# Altium schematic sheet Top Sheet.SchDoc
size A4; DocumentNumber: 1; SheetNumber: 1; SheetTotal: 11
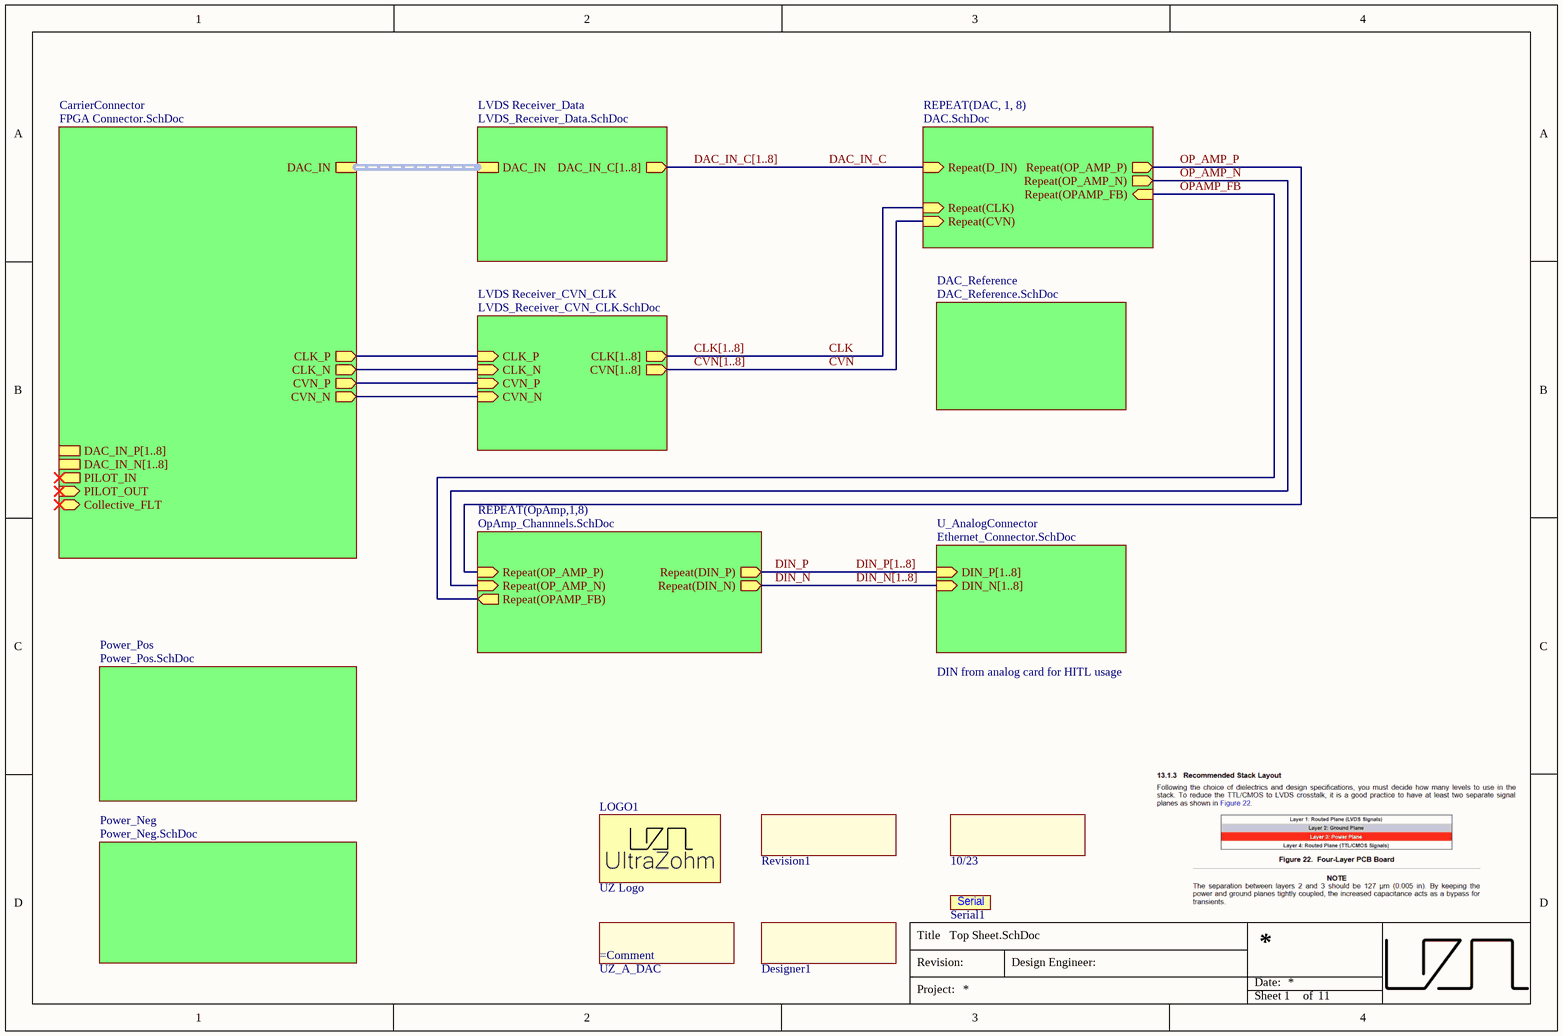
[diagram p0: Top Sheet.SchDoc]

## Parts
10/23  (no value)  [COMMENT]  (no BOM)
Designer1  (no value)  [Designator:comment]  (no BOM)
LOGO1  UZ Logo  [UZ_Logo_small]  (no BOM)
Revision1  (no value)  [Designator:comment]  (no BOM)
Serial1  Serial #  [SERIAL]  (value not drawn)
UZ_A_DAC  (no value)  [COMMENT]  (no BOM)

## Sub-sheets
CarrierConnector = FPGA Connector.SchDoc: CLK_P (out), CLK_N (out), CVN_P (out), CVN_N (out), PILOT_IN (out), PILOT_OUT (in), Collective_FLT (bidir), DAC_IN, DAC_IN_P[1..8], DAC_IN_N[1..8]
DAC_Reference = DAC_Reference.SchDoc: no entries
LVDS Receiver_CVN_CLK = LVDS_Receiver_CVN_CLK.SchDoc: CLK_P (in), CLK_N (in), CVN_P (in), CVN_N (in), CLK[1..8] (out), CVN[1..8] (out)
LVDS Receiver_Data = LVDS_Receiver_Data.SchDoc: DAC_IN, DAC_IN_C[1..8] (out)
Power_Neg = Power_Neg.SchDoc: no entries
Power_Pos = Power_Pos.SchDoc: no entries
REPEAT(DAC, 1, 8) = DAC.SchDoc: Repeat(CLK) (in), Repeat(D_IN) (in), Repeat(CVN) (in), Repeat(OP_AMP_P) (out), Repeat(OP_AMP_N) (out), Repeat(OPAMP_FB) (in)
REPEAT(OpAmp,1,8) = OpAmp_Channnels.SchDoc: Repeat(DIN_P) (out), Repeat(DIN_N) (out), Repeat(OP_AMP_P) (in), Repeat(OP_AMP_N) (in), Repeat(OPAMP_FB) (out)
U_AnalogConnector = Ethernet_Connector.SchDoc: DIN_P[1..8] (in), DIN_N[1..8] (in)

## Nets
CLK: sheet REPEAT(DAC, 1, 8)/Repeat(CLK)
CVN: sheet REPEAT(DAC, 1, 8)/Repeat(CVN)
DAC_IN_C: sheet REPEAT(DAC, 1, 8)/Repeat(D_IN)
DIN_N: sheet REPEAT(OpAmp,1,8)/Repeat(DIN_N)
DIN_P: sheet REPEAT(OpAmp,1,8)/Repeat(DIN_P)
OP_AMP_N: sheet REPEAT(DAC, 1, 8)/Repeat(OP_AMP_N), sheet REPEAT(OpAmp,1,8)/Repeat(OP_AMP_N)
OP_AMP_P: sheet REPEAT(DAC, 1, 8)/Repeat(OP_AMP_P), sheet REPEAT(OpAmp,1,8)/Repeat(OP_AMP_P)
OPAMP_FB: sheet REPEAT(DAC, 1, 8)/Repeat(OPAMP_FB), sheet REPEAT(OpAmp,1,8)/Repeat(OPAMP_FB)
(unnamed): sheet CarrierConnector/CLK_P, sheet LVDS Receiver_CVN_CLK/CLK_P
(unnamed): sheet CarrierConnector/CLK_N, sheet LVDS Receiver_CVN_CLK/CLK_N
(unnamed): sheet CarrierConnector/CVN_P, sheet LVDS Receiver_CVN_CLK/CVN_P
(unnamed): sheet CarrierConnector/CVN_N, sheet LVDS Receiver_CVN_CLK/CVN_N

## Buses and harness runs
bus CLK[1..8] = sheet LVDS Receiver_CVN_CLK/CLK[1..8]
bus CVN[1..8] = sheet LVDS Receiver_CVN_CLK/CVN[1..8]
bus DAC_IN_C[1..8] = sheet LVDS Receiver_Data/DAC_IN_C[1..8]
bus DIN_N[1..8] = sheet U_AnalogConnector/DIN_N[1..8]
bus DIN_P[1..8] = sheet U_AnalogConnector/DIN_P[1..8]
harness sheet CarrierConnector/DAC_IN = sheet LVDS Receiver_Data/DAC_IN

## Notes on the sheet
- DIN from analog card for HITL usage
- Title
- Revision:
- Design Engineer:
- Date:
- Project:
- Sheet
- of
- (in symbol 6) Serial

## Library data of the parts
10/23 = 5: Create a project parameter named "FinDate" this is the value of this component. It is printed on the PCB. Once the parameter is updated (e.g. new revision) it gets updated on the PCB as well; Manufacturer: PCB Manufacturer; Manufacturer Part Number: Project End Date; Created from: T. Wendt; PartID: 5; Created On: 01.03.2021 09:01:41; Component Type: Date of Project Finalization; Last Updated: 01.03.2021 09:01:41; Type: Standard (No BOM); Value: =FinDate; Live Cycle Status: 1
Designer1 = 4: Create a project parameter named "Author" this is the value of this component. It is printed on the PCB. Once the parameter is updated (e.g. new revision) it gets updated on the PCB as well; Manufacturer: PCB Manufacturer; Manufacturer Part Number: Project Author; Created from: T. Wendt; PartID: 4; Created On: 01.03.2021 08:53:41; Component Type: Project Author; Last Updated: 01.03.2021 09:20:27; Type: Standard (No BOM); Value: *; Live Cycle Status: 1
LOGO1 = Logo small: Manufacturer: UltraZohm; Created from: MGremer; Created: Jan2021_Liegmann; Value: Logo; Manufacturer Part Number: Logo small; PartID: 10; Created On: 03.11.2021 09:04:23; ComponentLink1Description: https://docs.ultrazohm.com/; ComponentLink1URL: homepage; Component Type: Logo; Last Updated: 03.11.2021 09:05:50; Supplier 1: -; Supplier Part Number 1: -; Type: Logo; Live Cycle Status: 1
Revision1 = 3: Create a project parameter named "ProjectRevision" this is the value of this component. It is printed on the PCB. Once the parameter is updated (e.g. new revision) it gets updated on the PCB as well; Manufacturer: PCB Manufacturer; Created from: T. Wendt; PartID: 3; Created On: 01.03.2021 08:50:34; Component Type: Project Revision; Last Updated: 01.03.2021 09:28:36; Manufacturer Part Number: Project Revision; Type: Standard (No BOM); Value: =ProjectRevision; Live Cycle Status: 1
Serial1 = 6: Field to put in a serial number; Manufacturer: PCB Manufacturer; Created from: T. Wendt; PartID: 6; Created On: 02.03.2021 14:31:24; Component Type: Serial Number; Last Updated: 02.03.2021 14:31:24; Manufacturer Part Number: Serial Number; Type: Standard (No BOM); Live Cycle Status: 1
UZ_A_DAC = 2: Create a project parameter named "ProjectNameCustom" this is the value of this component and it is printed on the PCB.; Manufacturer: PCB Manufacturer; Created from: T. Wendt; PartID: 2; Created On: 01.03.2021 08:43:57; Component Type: Project Name; Last Updated: 01.03.2021 09:07:27; Manufacturer Part Number: Project Name; Type: Standard (No BOM); Value: =ProjectNameCustom; Live Cycle Status: 1